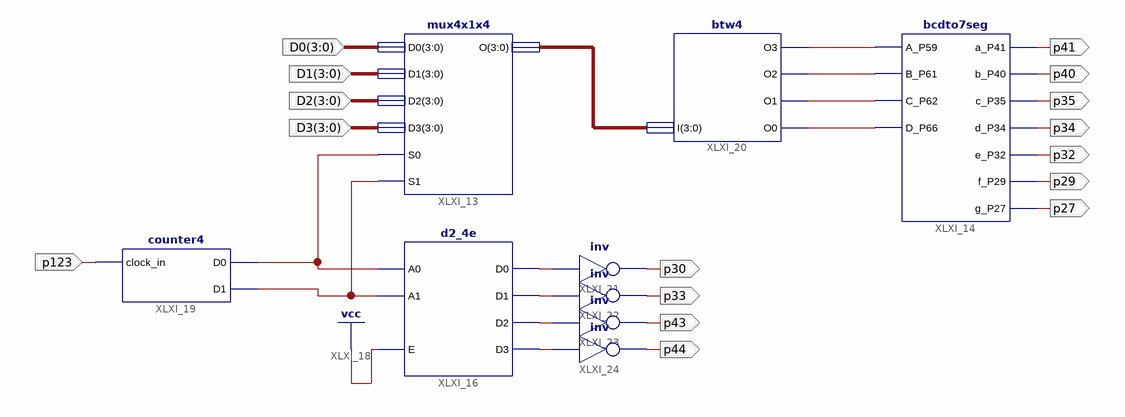
[diagram p0: schematic sheet 1]
// Xilinx ISE schematic display.sch (spartan6) as structural Verilog: 9 symbols, 16 ports
module display (
  input  [3:0] D0,
  input  [3:0] D1,
  input  [3:0] D2,
  input  [3:0] D3,
  input  p123,
  output p41,
  output p40,
  output p35,
  output p34,
  output p32,
  output p29,
  output p27,
  output p30,
  output p33,
  output p43,
  output p44
);

  wire XLXN_4, XLXN_5, XLXN_12, XLXN_13, XLXN_14, XLXN_15, XLXN_28, XLXN_29, XLXN_30, XLXN_31;
  wire [3:0] XLXN_11;

  mux4x1x4 XLXI_13 (.D0(D0), .D1(D1), .D2(D2), .D3(D3), .O(XLXN_11), .S0(XLXN_4), .S1(XLXN_5));
  bcdto7seg XLXI_14 (
    .a_P41(p41), .A_P59(XLXN_12), .b_P40(p40), .B_P61(XLXN_13), .c_P35(p35), .C_P62(XLXN_14), .d_P34(p34),
    .D_P66(XLXN_15), .e_P32(p32), .f_P29(p29), .g_P27(p27));
  d2_4e XLXI_16 (.A0(XLXN_4), .A1(XLXN_5), .E(1'b1), .D0(XLXN_28), .D1(XLXN_29), .D2(XLXN_30), .D3(XLXN_31));
  counter4 XLXI_19 (.clock_in(p123), .D0(XLXN_4), .D1(XLXN_5));
  btw4 XLXI_20 (.I(XLXN_11), .O0(XLXN_15), .O1(XLXN_14), .O2(XLXN_13), .O3(XLXN_12));
  not XLXI_21 (p30, XLXN_28);
  not XLXI_22 (p33, XLXN_29);
  not XLXI_23 (p43, XLXN_30);
  not XLXI_24 (p44, XLXN_31);
endmodule
